# EAGLE design HPFv2 (EAGLE 6.1)
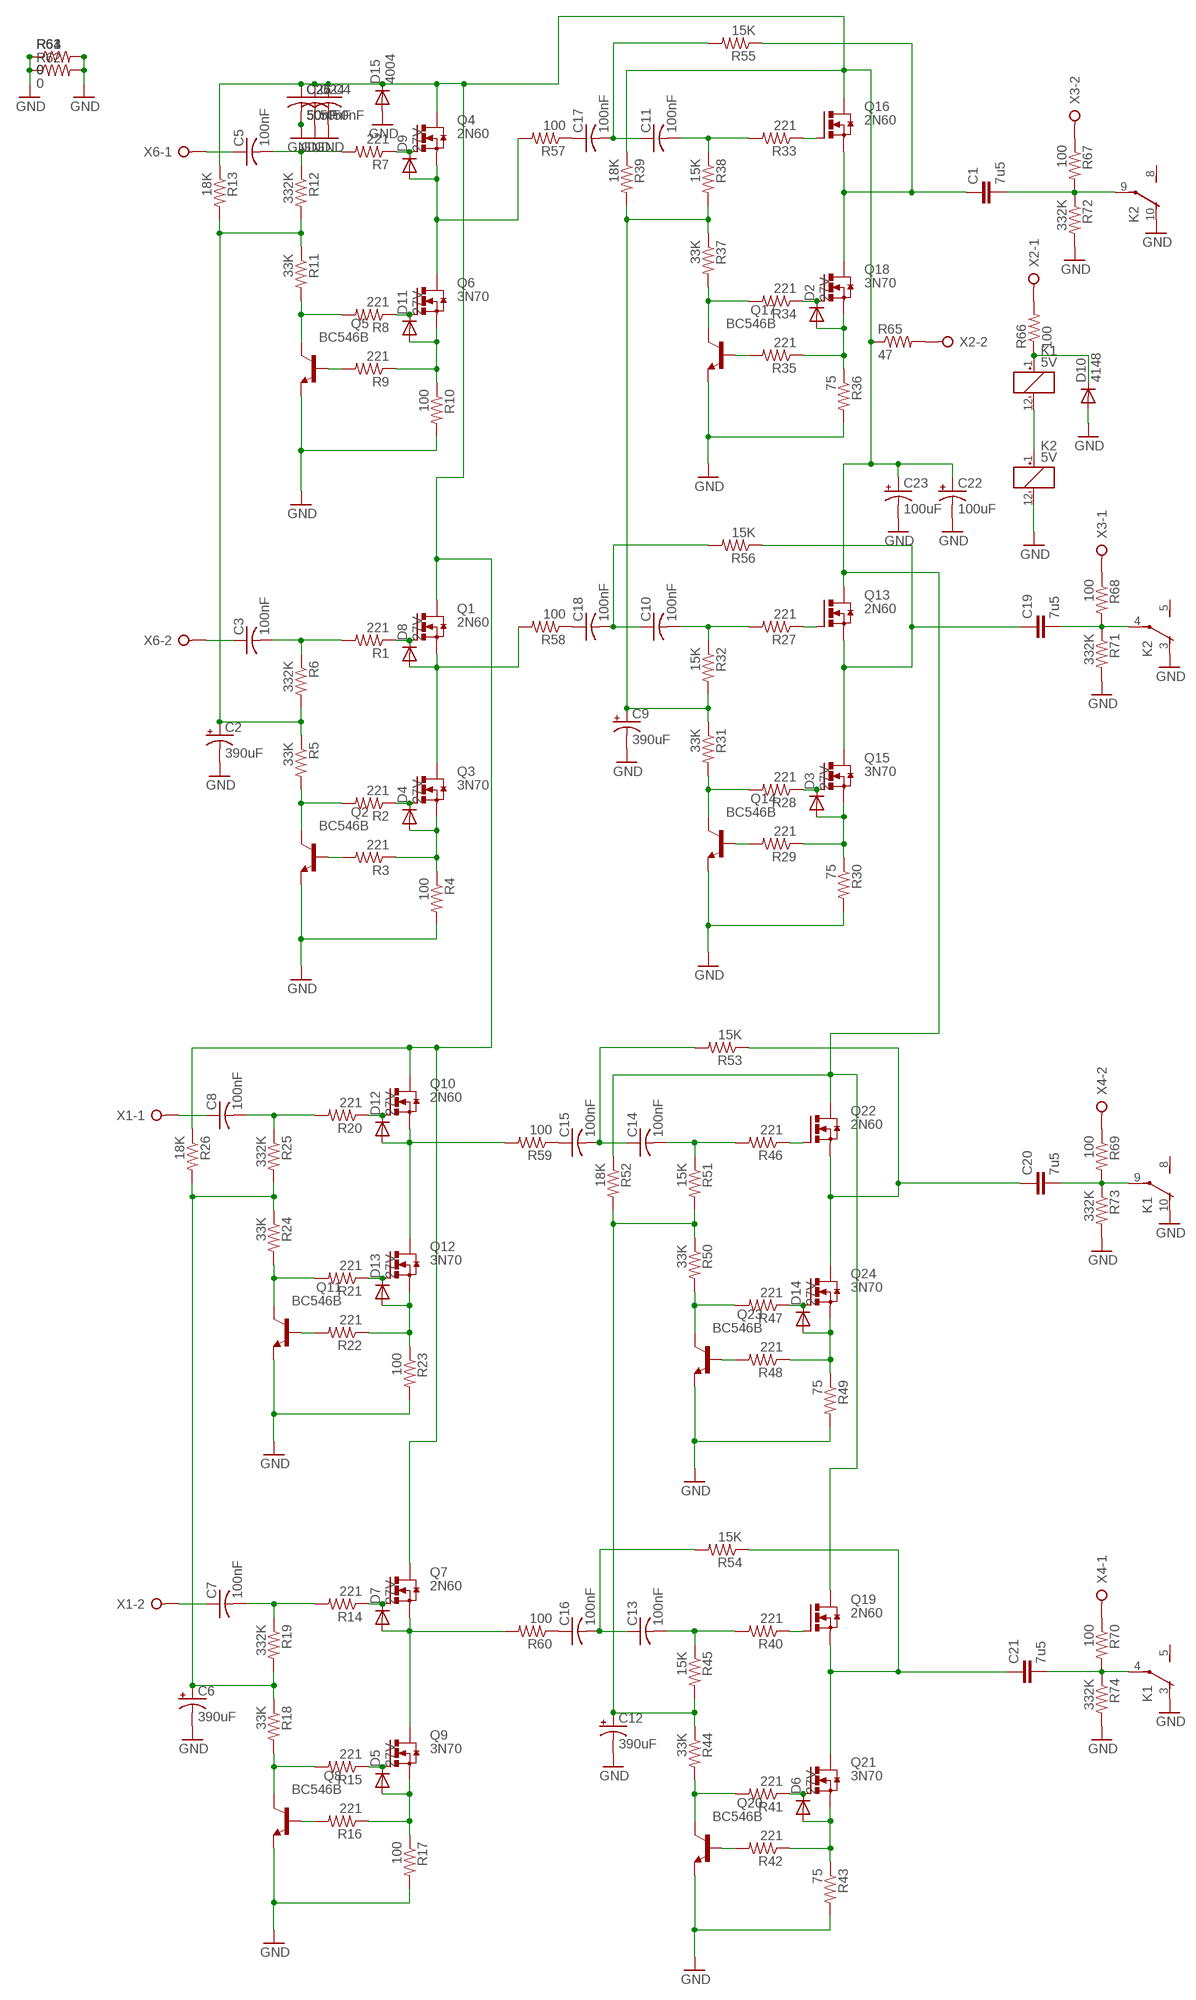
[diagram p0: schematic, sheet 1]

## Parts
C1  7u5  C37/20  [C37.5B20]
C2  390uF  CPOL-USE5-13  [E5-13]
C3  100nF  C-US050-075X075  [C050-075X075]
C4  50nF  C-US075-042X103  [C075-042X103]
C5  100nF  C-US050-075X075  [C050-075X075]
C6  390uF  CPOL-USE5-13  [E5-13]
C7  100nF  C-US050-075X075  [C050-075X075]
C8  100nF  C-US050-075X075  [C050-075X075]
C9  390uF  CPOL-USE5-13  [E5-13]
C10  100nF  C-US050-075X075  [C050-075X075]
C11  100nF  C-US050-075X075  [C050-075X075]
C12  390uF  CPOL-USE5-13  [E5-13]
C13  100nF  C-US050-075X075  [C050-075X075]
C14  100nF  C-US050-075X075  [C050-075X075]
C15  100nF  C-US050-075X075  [C050-075X075]
C16  100nF  C-US050-075X075  [C050-075X075]
C17  100nF  C-US050-075X075  [C050-075X075]
C18  100nF  C-US050-075X075  [C050-075X075]
C19  7u5  C37/20  [C37.5B20]
C20  7u5  C37/20  [C37.5B20]
C21  7u5  C37/20  [C37.5B20]
C22  100uF  CPOL-USE5-13  [E5-13]
C23  100uF  CPOL-USE5-13  [E5-13]
C24  50nF  C-US075-042X103  [C075-042X103]
C25  50nF  C-US075-042X103  [C075-042X103]
C26  50nF  C-US075-042X103  [C075-042X103]
C27  50nF  C-US075-042X103  [C075-042X103]
D2  27V  1N4148DO35-7  [DO35-7]
D3  27V  1N4148DO35-7  [DO35-7]
D4  27V  1N4148DO35-7  [DO35-7]
D5  27V  1N4148DO35-7  [DO35-7]
D6  27V  1N4148DO35-7  [DO35-7]
D7  27V  1N4148DO35-7  [DO35-7]
D8  27V  1N4148DO35-7  [DO35-7]
D9  27V  1N4148DO35-7  [DO35-7]
D10  4148  1N4148DO35-7  [DO35-7]
D11  27V  1N4148DO35-7  [DO35-7]
D12  27V  1N4148DO35-7  [DO35-7]
D13  27V  1N4148DO35-7  [DO35-7]
D14  27V  1N4148DO35-7  [DO35-7]
D15  4004  1N4148DO35-10  [DO35-10]
K1  5V  TX2-12V  [TX2]
K2  5V  TX2-12V  [TX2]
Q1  2N60  IRFI540NPBF  [TO220BH]
Q2  BC546B  BC546A  [TO92-EBC]
Q3  3N70  IRFI540NPBF  [TO220BH]
Q4  2N60  IRFI540NPBF  [TO220BH]
Q5  BC546B  BC546A  [TO92-EBC]
Q6  3N70  IRFI540NPBF  [TO220BH]
Q7  2N60  IRFI540NPBF  [TO220BH]
Q8  BC546B  BC546A  [TO92-EBC]
Q9  3N70  IRFI540NPBF  [TO220BH]
Q10  2N60  IRFI540NPBF  [TO220BH]
Q11  BC546B  BC546A  [TO92-EBC]
Q12  3N70  IRFI540NPBF  [TO220BH]
Q13  2N60  IRFI540NPBF  [TO220BH]
Q14  BC546B  BC546A  [TO92-EBC]
Q15  3N70  IRFI540NPBF  [TO220BH]
Q16  2N60  IRFI540NPBF  [TO220BH]
Q17  BC546B  BC546A  [TO92-EBC]
Q18  3N70  IRFI540NPBF  [TO220BH]
Q19  2N60  IRFI540NPBF  [TO220BH]
Q20  BC546B  BC546A  [TO92-EBC]
Q21  3N70  IRFI540NPBF  [TO220BH]
Q22  2N60  IRFI540NPBF  [TO220BH]
Q23  BC546B  BC546A  [TO92-EBC]
Q24  3N70  IRFI540NPBF  [TO220BH]
R1  221  R-US_0207/10  [0207/10]
R2  221  R-US_0207/10  [0207/10]
R3  221  R-US_0207/10  [0207/10]
R4  100  R-US_0207/10  [0207/10]
R5  33K  R-US_0207/10  [0207/10]
R6  332K  R-US_0207/10  [0207/10]
R7  221  R-US_0207/10  [0207/10]
R8  221  R-US_0207/10  [0207/10]
R9  221  R-US_0207/10  [0207/10]
R10  100  R-US_0207/10  [0207/10]
R11  33K  R-US_0207/10  [0207/10]
R12  332K  R-US_0207/10  [0207/10]
R13  18K  R-US_0207/10  [0207/10]
R14  221  R-US_0207/10  [0207/10]
R15  221  R-US_0207/10  [0207/10]
R16  221  R-US_0207/10  [0207/10]
R17  100  R-US_0207/10  [0207/10]
R18  33K  R-US_0207/10  [0207/10]
R19  332K  R-US_0207/10  [0207/10]
R20  221  R-US_0207/10  [0207/10]
R21  221  R-US_0207/10  [0207/10]
R22  221  R-US_0207/10  [0207/10]
R23  100  R-US_0207/10  [0207/10]
R24  33K  R-US_0207/10  [0207/10]
R25  332K  R-US_0207/10  [0207/10]
R26  18K  R-US_0207/10  [0207/10]
R27  221  R-US_0207/10  [0207/10]
R28  221  R-US_0207/10  [0207/10]
R29  221  R-US_0207/10  [0207/10]
R30  75  R-US_0207/10  [0207/10]
R31  33K  R-US_0207/10  [0207/10]
R32  15K  R-US_0207/10  [0207/10]
R33  221  R-US_0207/10  [0207/10]
R34  221  R-US_0207/10  [0207/10]
R35  221  R-US_0207/10  [0207/10]
R36  75  R-US_0207/10  [0207/10]
R37  33K  R-US_0207/10  [0207/10]
R38  15K  R-US_0207/10  [0207/10]
R39  18K  R-US_0207/10  [0207/10]
R40  221  R-US_0207/10  [0207/10]
R41  221  R-US_0207/10  [0207/10]
R42  221  R-US_0207/10  [0207/10]
R43  75  R-US_0207/10  [0207/10]
R44  33K  R-US_0207/10  [0207/10]
R45  15K  R-US_0207/10  [0207/10]
R46  221  R-US_0207/10  [0207/10]
R47  221  R-US_0207/10  [0207/10]
R48  221  R-US_0207/10  [0207/10]
R49  75  R-US_0207/10  [0207/10]
R50  33K  R-US_0207/10  [0207/10]
R51  15K  R-US_0207/10  [0207/10]
R52  18K  R-US_0207/10  [0207/10]
R53  15K  R-US_0207/10  [0207/10]
R54  15K  R-US_0207/10  [0207/10]
R55  15K  R-US_0207/10  [0207/10]
R56  15K  R-US_0207/10  [0207/10]
R57  100  R-US_0207/10  [0207/10]
R58  100  R-US_0207/10  [0207/10]
R59  100  R-US_0207/10  [0207/10]
R60  100  R-US_0207/10  [0207/10]
R61  0  R-US_0207/10  [0207/10]
R62  0  R-US_0204/7  [0204/7]
R63  0  R-US_0207/10  [0207/10]
R64  0  R-US_0207/10  [0207/10]
R65  47  R-US_0617/22  [0617/22]
R66  100  R-US_0309/12  [0309/12]
R67  100  R-US_0207/10  [0207/10]
R68  100  R-US_0207/10  [0207/10]
R69  100  R-US_0207/10  [0207/10]
R70  100  R-US_0207/10  [0207/10]
R71  332K  R-US_0207/10  [0207/10]
R72  332K  R-US_0207/10  [0207/10]
R73  332K  R-US_0207/10  [0207/10]
R74  332K  R-US_0207/10  [0207/10]
X1  W237-02P  [W237-132]
X2  W237-02P  [W237-132]
X3  W237-02P  [W237-132]
X4  W237-02P  [W237-132]
X6  W237-02P  [W237-132]

## Nets
GND: C2.- C4.2 C6.- C9.- C12.- C22.- C23.- C24.2 C25.2 C26.2 C27.2 D10.A D15.A K1.3(1:O) K1.10(2:O) K2.3(1:O) K2.10(2:O) K2.12(_:-) Q2.E Q5.E Q8.E Q11.E Q14.E Q17.E Q20.E Q23.E R4.2 R10.2 R17.2 R23.2 R30.2 R36.2 R43.2 R49.2 R61.1 R61.2 R62.1 R62.2 R63.1 R63.2 R64.1 R64.2 R71.2 R72.2 R73.2 R74.2
N$1: Q2.B R3.2
N$2: D4.A Q3.S R3.1 R4.1
N$3: D4.C Q3.G R2.1
N$4: Q2.C R2.2 R5.2
N$5: C3.2 R1.2 R6.1
N$6: D8.A Q1.S Q3.D R58.2
N$7: D8.C Q1.G R1.1
N$8: C5.1 X6.1
N$9: Q5.B R9.2
N$10: D11.A Q6.S R9.1 R10.1
N$11: D11.C Q6.G R8.1
N$12: Q5.C R8.2 R11.2
N$13: D9.A Q4.S Q6.D R57.2
N$14: D9.C Q4.G R7.1
N$15: C5.2 R7.2 R12.1
N$16: C2.+ R5.1 R6.2 R11.1 R12.2 R13.2
N$17: C4.1 C22.+ C23.+ C24.1 C25.1 C26.1 C27.1 D15.C Q1.D Q4.D Q7.D Q10.D Q13.D Q16.D Q19.D Q22.D R13.1 R26.1 R39.1 R52.1 R65.1
N$18: C3.1 X6.2
N$19: Q8.B R16.2
N$20: D5.A Q9.S R16.1 R17.1
N$21: D5.C Q9.G R15.1
N$22: Q8.C R15.2 R18.2
N$23: D7.A Q7.S Q9.D R60.2
N$24: D7.C Q7.G R14.1
N$25: C7.2 R14.2 R19.1
N$26: Q11.B R22.2
N$27: D13.A Q12.S R22.1 R23.1
N$28: D13.C Q12.G R21.1
N$29: Q11.C R21.2 R24.2
N$30: D12.A Q10.S Q12.D R59.2
N$31: D12.C Q10.G R20.1
N$32: C8.2 R20.2 R25.1
N$33: C6.+ R18.1 R19.2 R24.1 R25.2 R26.2
N$34: C21.2 K1.4(1:P) R70.2 R74.1
N$35: C8.1 X1.1
N$36: C7.1 X1.2
N$37: Q14.B R29.2
N$38: D3.A Q15.S R29.1 R30.1
N$39: D3.C Q15.G R28.1
N$40: Q14.C R28.2 R31.2
N$41: C19.1 Q13.S Q15.D R56.1
N$42: Q13.G R27.1
N$43: C10.2 R27.2 R32.1
N$44: Q17.B R35.2
N$45: D2.A Q18.S R35.1 R36.1
N$46: D2.C Q18.G R34.1
N$47: Q17.C R34.2 R37.2
N$48: C1.1 Q16.S Q18.D R55.1
N$49: Q16.G R33.1
N$50: C11.2 R33.2 R38.1
N$51: C9.+ R31.1 R32.2 R37.1 R38.2 R39.2
N$52: C20.2 K1.9(2:P) R69.2 R73.1
N$53: C11.1 C17.2 R55.2
N$54: C10.1 C18.2 R56.2
N$55: Q20.B R42.2
N$56: D6.A Q21.S R42.1 R43.1
N$57: D6.C Q21.G R41.1
N$58: Q20.C R41.2 R44.2
N$59: C21.1 Q19.S Q21.D R54.1
N$60: Q19.G R40.1
N$61: C13.2 R40.2 R45.1
N$62: Q23.B R48.2
N$63: D14.A Q24.S R48.1 R49.1
N$64: D14.C Q24.G R47.1
N$65: Q23.C R47.2 R50.2
N$66: C20.1 Q22.S Q24.D R53.1
N$67: Q22.G R46.1
N$68: C14.2 R46.2 R51.1
N$69: C12.+ R44.1 R45.2 R50.1 R51.2 R52.2
N$70: C19.2 K2.4(1:P) R68.2 R71.1
N$71: C14.1 C15.2 R53.2
N$72: C13.1 C16.2 R54.2
N$73: C17.1 R57.1
N$74: C18.1 R58.1
N$75: C15.1 R59.1
N$76: C16.1 R60.1
N$77: C1.2 K2.9(2:P) R67.2 R72.1
N$79: R65.2 X2.2
N$80: D10.C K1.1(_:+) R66.1
N$81: R66.2 X2.1
N$82: R68.1 X3.1
N$83: R67.1 X3.2
N$84: R69.1 X4.2
N$85: R70.1 X4.1
N$86: K1.12(_:-) K2.1(_:+)
Unconnected: K1.5(1:S) K1.8(2:S) K2.5(1:S) K2.8(2:S)

## Library data of the parts
C1 C19-C21 = capacitor-wima:C: CAPACITOR naming: grid - package width
C2 C6 C9 C12 C22 C23 = resistor:CPOL-US: POLARIZED CAPACITOR, American symbol
C3-C5 C7 C8 C10 C11 C13-C18 C24-C27 = resistor:C-US: CAPACITOR, American symbol
D2-D15 = diode:1N4148: DIODE high speed (Philips)
K1 K2 = relay:TX2?-*: 2 AMP. HIGH CAPACITY RELAY NAiS WITH HIGH SURGE VOLTAGE & HIGH BREAKDOWN VOLTAGE Source: http://www.mew-europe.com/.. en_ds_61022_0001.pdf; MF: AROMAT/ MATSUSHITA; MPN: TX2-12V; OC_FARNELL: 1200952; OC_NEWARK: 67K1295
Q1 Q3 Q4 Q6 Q7 Q9 Q10 Q12 Q13 Q15 Q16 Q18 Q19 Q21 Q22 Q24 = transistor-power:IRFI540NPBF: HEXFET Power MOISFET VDSS = 100V, RDS(on) = 0.052 Ohm, ID = 20A, VGS(th) = 2.0 -- 4.0V Source: http://www.irf.com/product-info/datasheets/data/irfi540npbf.pdf
Q2 Q5 Q8 Q11 Q14 Q17 Q20 Q23 = transistor-npn:BC546*: NPN Transistor
R1-R74 = resistor:R-US_: RESISTOR, American symbol
X1-X4 X6 = con-wago-508:W237-02P: WAGO SREW CLAMP; OC_FARNELL: unknown; OC_NEWARK: unknown

## Board
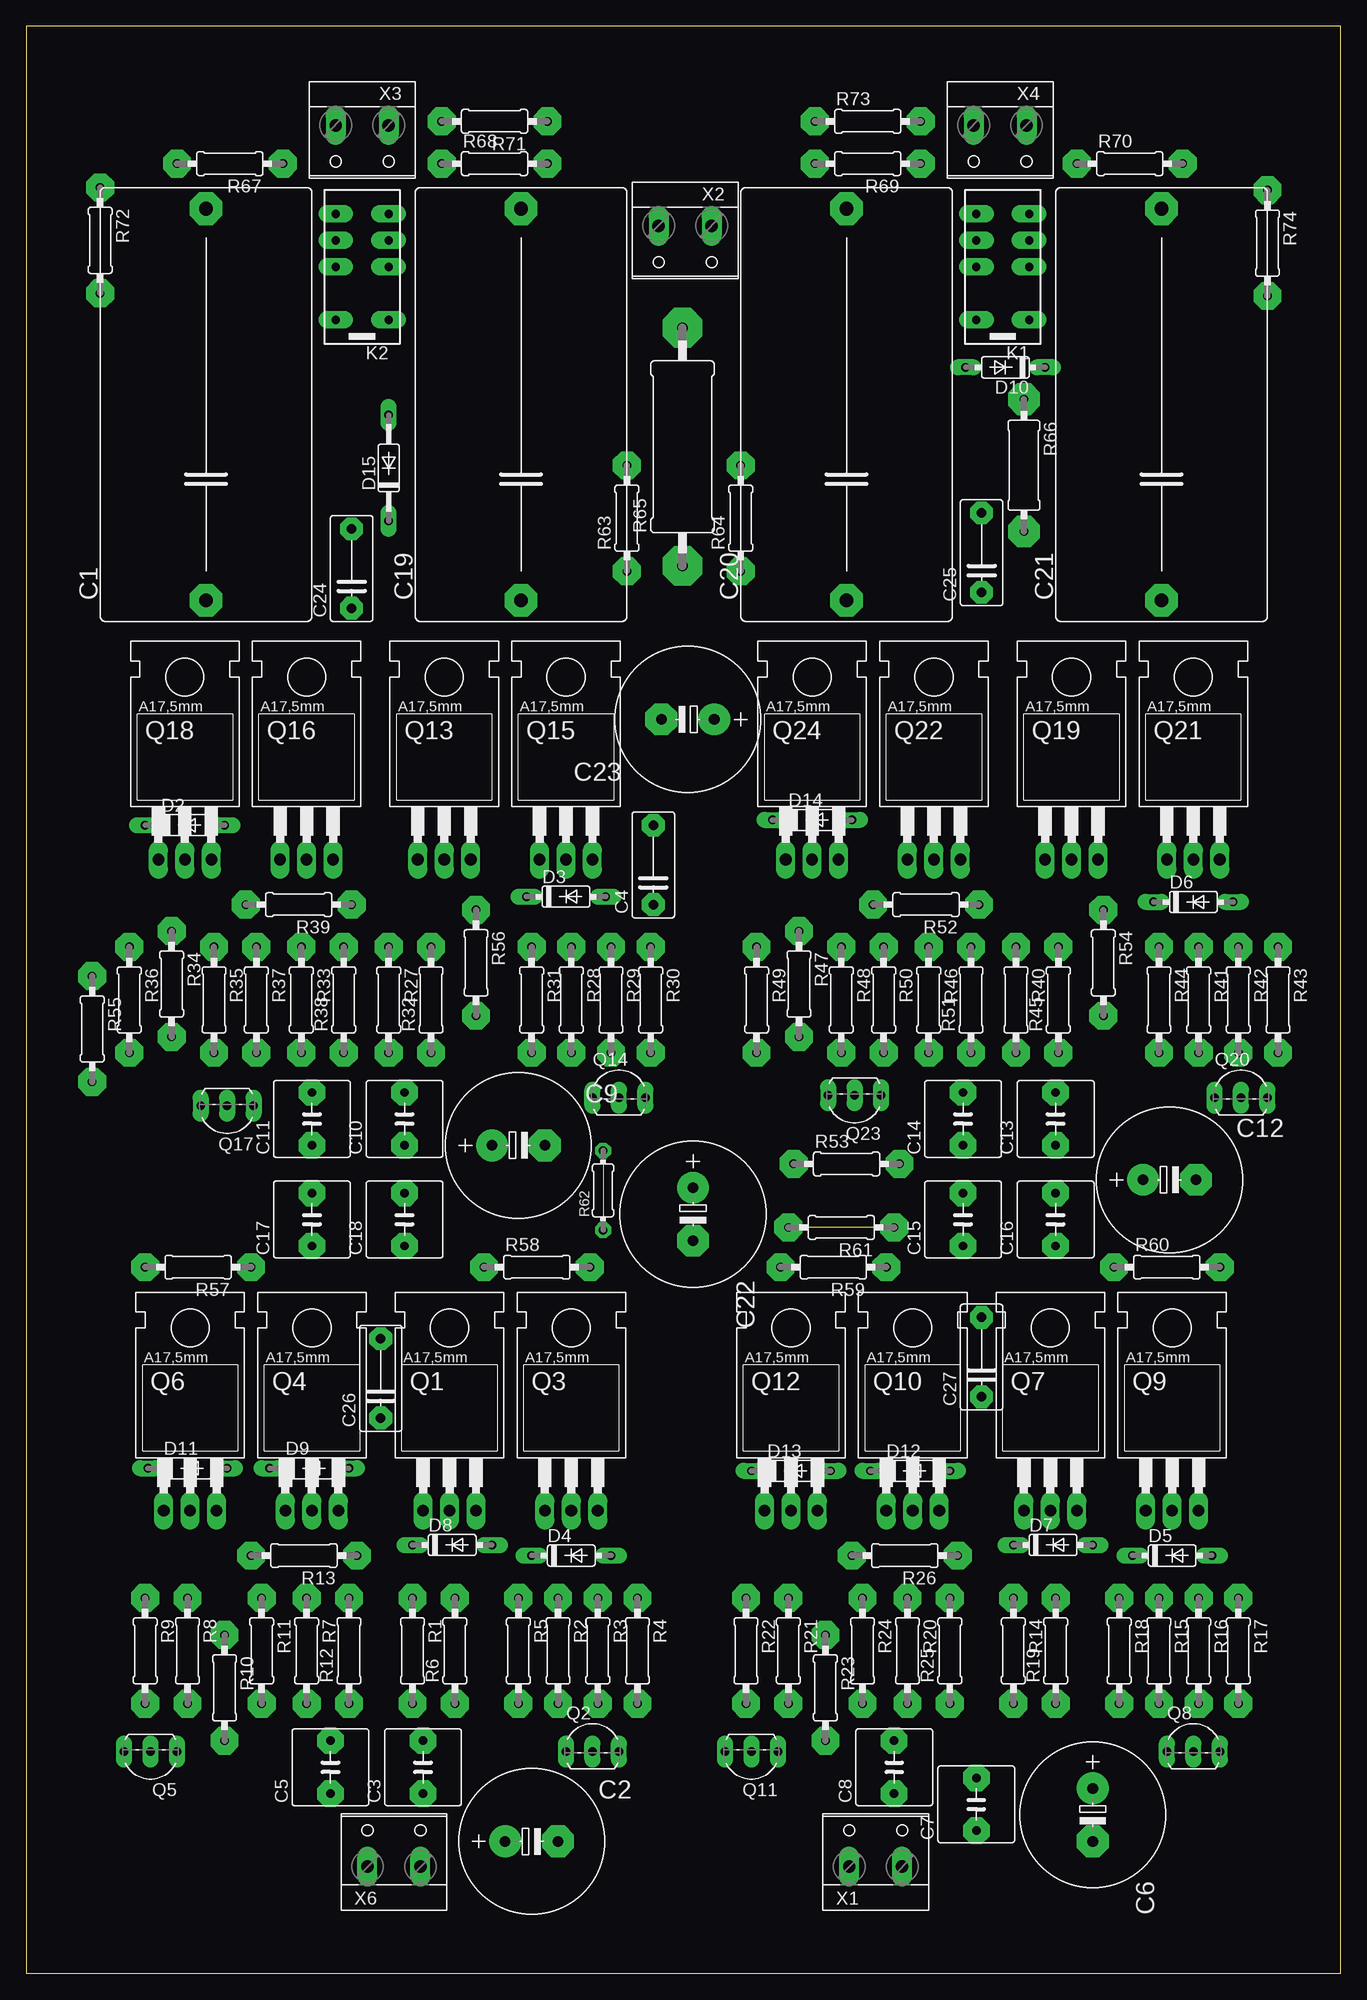
[diagram p1: board, top side]
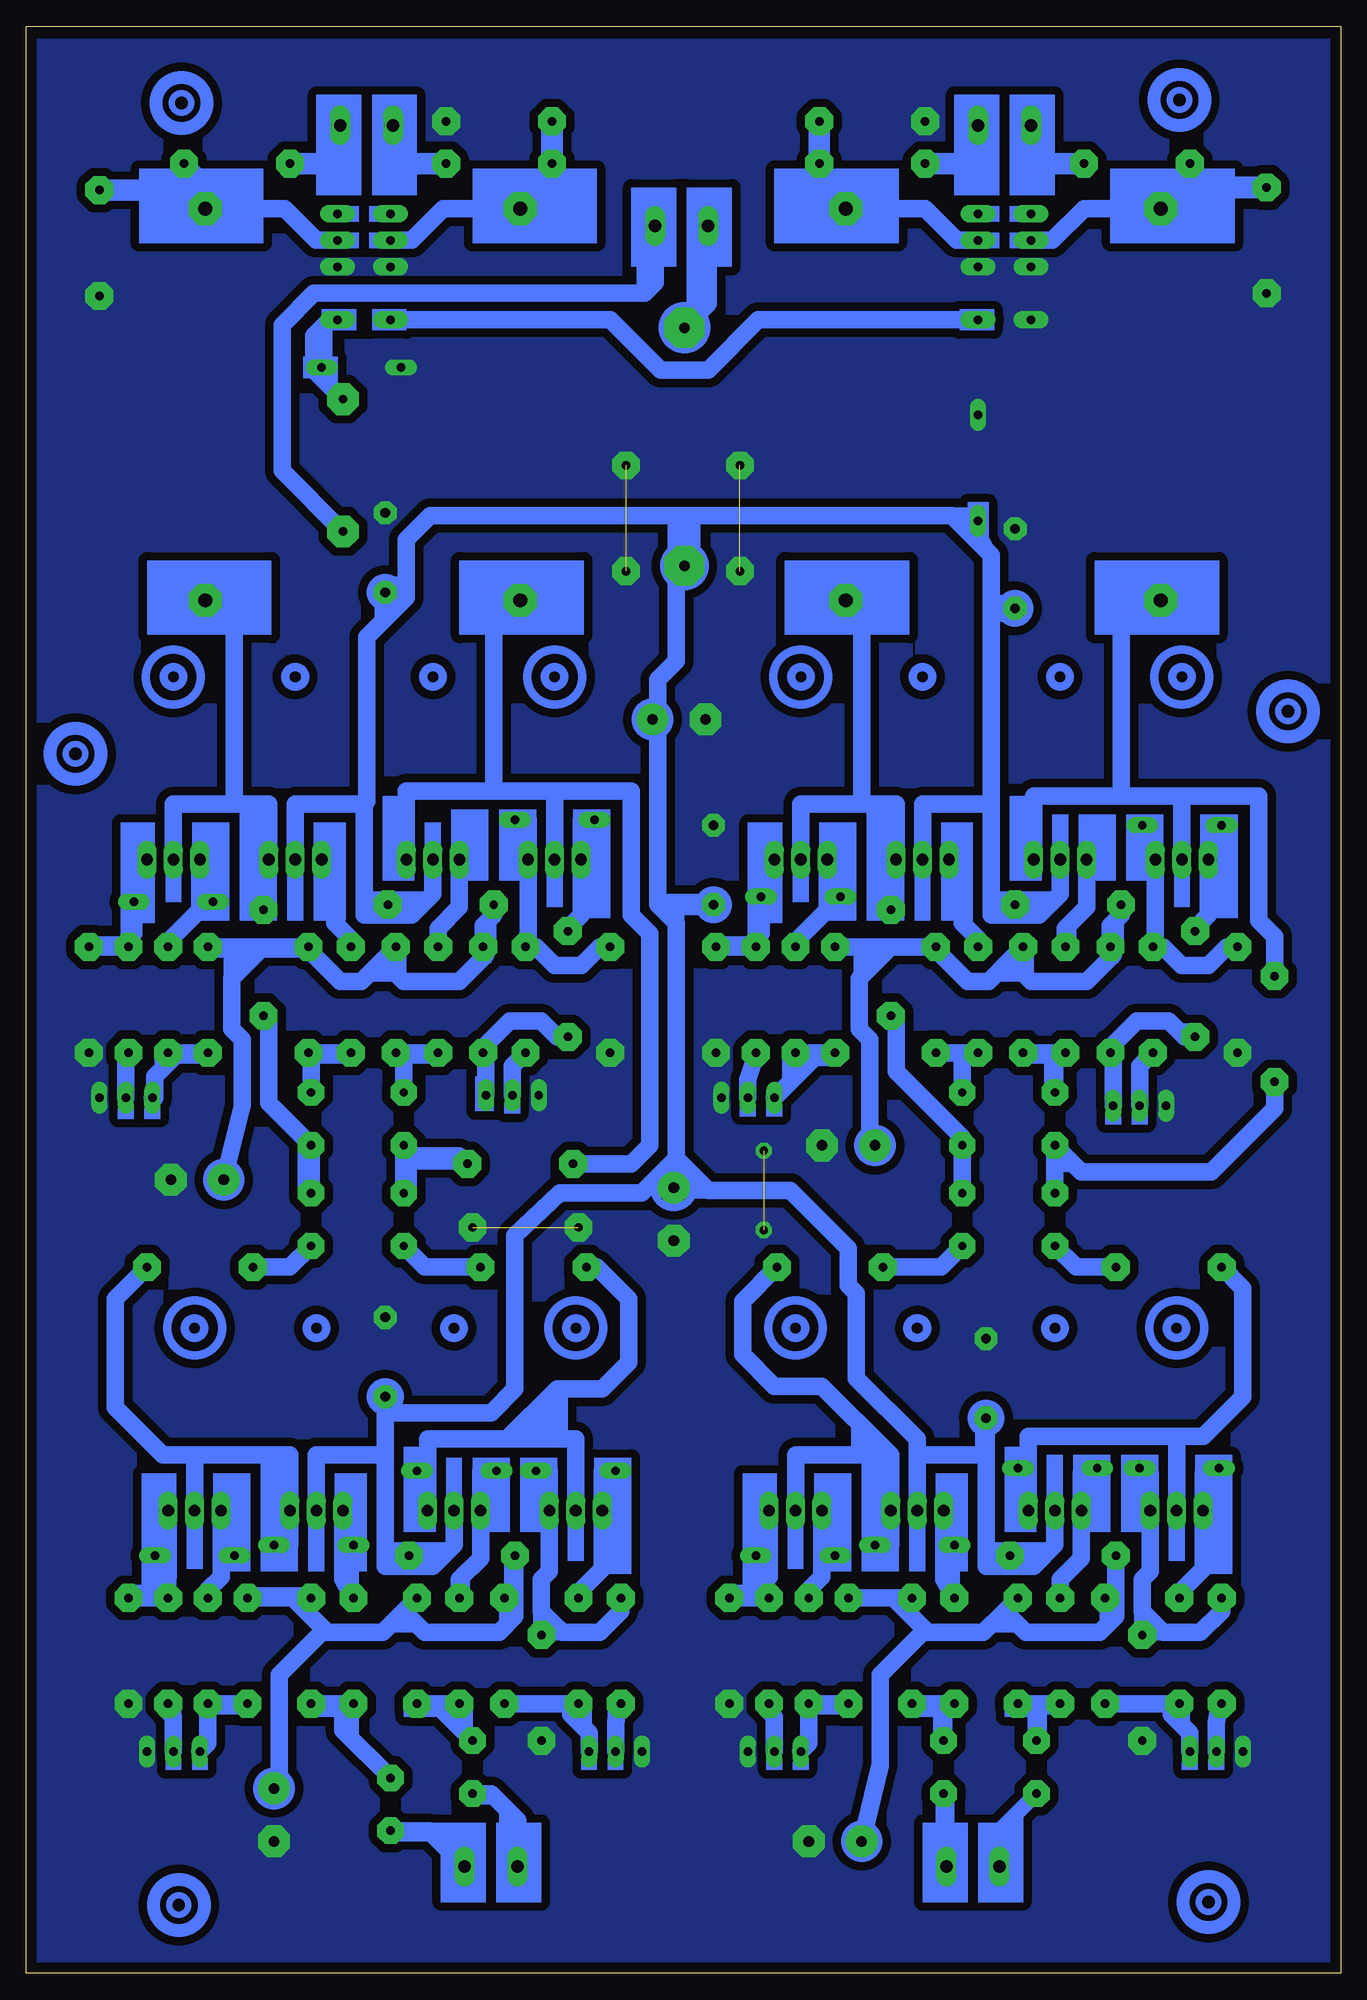
[diagram p2: board, bottom side, seen from below]

Size 126.16 x 186.92 mm. Coordinates in mm from the lower left corner, seen from the top.
Outline: 0,186.92 0,0 126.16,0 126.16,186.92 0,186.92
Copper layers (1*16): Top 0.035mm / dielectric 1.5mm / Bottom 0.035mm
Design rules: minimum track width 10mil, minimum drill 24mil, track to track 8mil, track to pad 8mil, pad to pad 8mil, via to via 8mil, smd to smd 8mil, copper to edge 40mil, drill to drill 8mil, minimum pad ring 14mil, minimum via ring 8mil, stop-mask expansion 4mil, vias tented up to drill 0mil, thermal gap 10mil

### Footprints (pad centres in the part's own frame; a part is rotated, then mirrored left to right if it is on the bottom)
C37.5B20 = drill 1.321 pad 3.15 octagon: 1 -18.796,0; 2 18.796,0
E5-13 = drill 1.016 pad 3.048: + -2.54,0 | drill 1.016 pad 3.048 octagon: - 2.54,0
C050-075X075 = drill 0.813 pad 2.54 octagon: 1 -2.54,0; 2 2.54,0
C075-042X103 = drill 0.914 pad 2.184 octagon: 1 -3.81,0; 2 3.81,0
DO35-7 = drill 0.813 long: A 3.81,0; C -3.81,0
DO35-10 = drill 0.813 long: A 5.08,0; C -5.08,0
TX2 = drill 0.8 pad 1.676 long: 1 -5.08,-2.54; 3 0,-2.54; 4 2.54,-2.54; 5 5.08,-2.54; 8 5.08,2.54; 9 2.54,2.54; 10 0,2.54; 12 -5.08,2.54
TO220BH = drill 1.118 long: D 0,-6.35; G -2.54,-6.35; S 2.54,-6.35
TO92-EBC = drill 0.813 long: B 0,-1.27; C -2.54,-1.27; E 2.54,-1.27
0207/10 = drill 0.813 pad 2.667 octagon: 1 -5.08,0; 2 5.08,0
0204/7 = drill 0.813 octagon: 1 -3.81,0; 2 3.81,0
0617/22 = drill 1.016 pad 3.81 octagon: 1 -11.43,0; 2 11.43,0
0309/12 = drill 0.813 pad 3.048 octagon: 1 -6.35,0; 2 6.35,0
W237-132 = drill 1.194 long: 1 -2.54,-0.635; 2 2.54,-0.635

### Placement (x,y rotation side)
C1  17.27,150.6 90 top
C2  48.51,12.68 0 top
C3  38.1,19.79 90 top
C4  60.2,106.41 90 top
C5  29.21,19.79 90 top
C6  102.36,15.22 270 top
C7  91.19,16.24 90 top
C8  83.31,19.79 90 top
C9  47.24,79.48 0 top
C10  36.32,82.02 90 top
C11  27.43,82.02 90 top
C12  109.73,76.18 0 top
C13  98.81,82.02 90 top
C14  89.92,82.02 90 top
C15  89.92,72.37 90 top
C16  98.81,72.37 90 top
C17  27.43,72.37 90 top
C18  36.32,72.37 90 top
C19  47.5,150.6 90 top
C20  78.74,150.6 90 top
C21  108.97,150.6 90 top
C22  64.01,72.88 270 top
C23  63.5,120.38 180 top
C24  31.24,134.85 90 top
C25  91.69,136.38 90 top
C26  34.04,57.13 90 top
C27  91.69,59.16 90 top
D2  15.24,110.22 0 top
D3  51.82,103.36 0 top
D4  52.32,40.11 0 top
D5  109.98,40.11 0 top
D6  112.01,102.85 0 top
D7  98.55,41.13 0 top
D8  40.89,41.13 0 top
D9  27.18,48.49 0 top
D10  93.98,154.16 180 top
D11  15.49,48.49 0 top
D12  84.84,48.24 0 top
D13  73.41,48.24 0 top
D14  75.44,110.72 0 top
D15  34.8,144.51 90 top
K1  93.73,163.81 90 top
K2  32.26,163.81 90 top
Q1  40.64,50.78 0 top
Q2  54.36,22.59 0 top
Q3  52.32,50.78 0 top
Q4  27.43,50.78 0 top
Q5  11.94,20.05 180 top
Q6  15.75,50.78 0 top
Q7  98.3,50.78 0 top
Q8  112.01,22.59 0 top
Q9  109.98,50.78 0 top
Q10  85.09,50.78 0 top
Q11  69.6,20.05 180 top
Q12  73.41,50.78 0 top
Q13  40.13,113.26 0 top
Q14  56.9,85.32 0 top
Q15  51.82,113.26 0 top
Q16  26.92,113.26 0 top
Q17  19.3,82.02 180 top
Q18  15.24,113.26 0 top
Q19  100.33,113.26 0 top
Q20  116.59,85.32 0 top
Q21  112.01,113.26 0 top
Q22  87.12,113.26 0 top
Q23  79.5,83.04 180 top
Q24  75.44,113.26 0 top
R1  37.08,30.97 270 top
R2  51.05,30.97 270 top
R3  54.86,30.97 270 top
R4  58.67,30.97 270 top
R5  47.24,30.97 270 top
R6  41.15,30.97 90 top
R7  26.92,30.97 270 top
R8  15.49,30.97 270 top
R9  11.43,30.97 270 top
R10  19.05,27.41 270 top
R11  22.61,30.97 270 top
R12  30.99,30.97 90 top
R13  26.67,40.11 180 top
R14  94.74,30.97 270 top
R15  108.71,30.97 270 top
R16  112.52,30.97 270 top
R17  116.33,30.97 270 top
R18  104.9,30.97 270 top
R19  98.81,30.97 90 top
R20  84.58,30.97 270 top
R21  73.15,30.97 270 top
R22  69.09,30.97 270 top
R23  76.71,27.41 270 top
R24  80.26,30.97 270 top
R25  88.65,30.97 90 top
R26  84.33,40.11 180 top
R27  34.8,93.45 270 top
R28  52.32,93.45 270 top
R29  56.13,93.45 270 top
R30  59.94,93.45 270 top
R31  48.51,93.45 270 top
R32  38.86,93.45 90 top
R33  26.42,93.45 270 top
R34  13.97,94.98 270 top
R35  18.03,93.45 270 top
R36  9.91,93.45 270 top
R37  22.1,93.45 270 top
R38  30.48,93.45 90 top
R39  26.16,102.6 180 top
R40  95,93.45 270 top
R41  112.52,93.45 270 top
R42  116.33,93.45 270 top
R43  120.14,93.45 270 top
R44  108.71,93.45 270 top
R45  99.06,93.45 90 top
R46  86.61,93.45 270 top
R47  74.17,94.98 270 top
R48  78.23,93.45 270 top
R49  70.1,93.45 270 top
R50  82.3,93.45 270 top
R51  90.68,93.45 90 top
R52  86.36,102.6 180 top
R53  78.74,77.7 0 top
R54  103.38,97.01 270 top
R55  6.35,90.66 270 top
R56  43.18,97.01 270 top
R57  16.51,67.8 180 top
R58  49.02,67.8 0 top
R59  77.47,67.8 180 top
R60  109.47,67.8 0 top
R61  78.23,71.61 180 top
R62  55.37,75.16 90 top
R63  57.66,139.68 90 top
R64  68.58,139.68 90 top
R65  62.99,146.54 90 top
R66  95.76,144.76 270 top
R67  19.56,173.72 180 top
R68  44.96,173.72 0 top
R69  80.77,173.72 180 top
R70  105.92,173.72 0 top
R71  44.96,177.78 180 top
R72  7.11,166.35 270 top
R73  80.77,177.78 0 top
R74  119.13,166.1 270 top
X1  81.53,10.9 0 top
X2  63.25,167.11 180 top
X3  32.26,176.76 180 top
X4  93.47,176.76 180 top
X6  35.31,10.9 0 top

### Tracks (layer width: path | path; a pad name or v marks a point on that pad's centre or on a via)
GND  (4 unrouted)
  pour Bottom (isolate 0.813, no thermals): 125.22,184.89 0.25,184.89 0.25,1.76 125.22,1.76
N$1
  Bottom 1.676: Q2.B 54.36,24.62 54.86,25.13 R3.2
N$2
  Bottom 1.676: 56.9,36.05 R3.1 | 56.9,36.05 54.86,38.08 54.86,40.11 | 54.86,40.11 Q3.S | R4.1 56.9,36.05 | D4.A 54.86,40.11
N$3
  Bottom 1.676: R2.1 51.05,36.81 49.78,38.08 49.78,40.11 | 49.78,40.11 Q3.G | D4.C 49.78,40.11
N$4
  Bottom 1.676: Q2.C 51.05,22.08 R2.2 R5.2
N$5
  Bottom 1.676: R1.2 38.1,25.89 | 38.1,25.89 R6.1 | C3.2 38.1,25.89
N$6
  Bottom 1.676: 43.43,49.76 43.18,49.76 Q1.S 43.18,41.13 D8.A | 43.43,49.76 52.32,49.76 Q3.D | R58.2 57.4,64.5 57.4,59.42 54.36,56.37 49.78,56.37 43.43,50.02 43.43,49.76
N$7
  Bottom 1.676: R1.1 38.1,37.83 38.1,40.87 38.1,41.13 | 38.1,41.13 Q1.G | D8.C 38.1,41.13
N$8
  Bottom 1.422: C5.1 32.77,13.7 X6.1
N$9
  Bottom 1.676: Q5.B 11.94,24.11 11.68,25.63 R9.2
N$10
  Bottom 1.676: R9.1 11.43,34.78 13.46,32.75 17.02,32.75 18.03,33.76 | 18.03,33.76 19.05,34.78 19.05,37.83 18.29,38.59 Q6.S 18.29,47.99 D11.A | R10.1 18.03,33.51 18.03,33.76
N$11
  Bottom 1.676: R8.1 15.49,36.56 13.21,38.84 Q6.G 13.21,47.99 D11.C
N$12
  Bottom 1.676: R8.2 16.26,25.89 | 16.26,25.89 R11.2 | Q5.C 14.48,23.09 16.26,24.87 16.26,25.89
N$13
  Bottom 1.676: Q6.D 15.75,51.54 | 15.75,51.54 29.97,51.54 29.97,47.99 | R57.2 9.4,65.77 9.4,55.35 13.21,51.54 15.75,51.54 | D9.A 29.97,47.99 | 29.97,47.99 Q4.S
N$14
  Bottom 1.676: R7.1 26.92,37.83 24.89,39.86 Q4.G 24.89,47.99 D9.C
N$15
  Bottom 1.676: R7.2 29.21,25.89 | 29.21,25.89 R12.1 | C5.2 29.21,25.89
N$16
  Bottom 1.676: 32.26,34.78 30.23,32.75 23.11,32.75 21.59,34.27 21.59,35.79 | R12.2 32.26,34.78 | 32.26,34.78 34.29,32.75 39.62,32.75 | 39.62,32.75 42.93,36.05 | 42.93,36.05 R6.2 | R5.1 42.93,36.05 | 21.59,35.79 R13.2 | R11.1 22.35,35.79 21.59,35.79 | C2.+ 44.2,20.05 44.2,28.68 40.13,32.75 39.62,32.75
N$17
  Bottom 1.676: Q4.D 27.43,41.13 29.46,39.1 31.24,39.1 | 31.24,39.1 34.04,39.1 34.04,49.76 | 34.04,49.76 40.64,49.76 Q1.D 40.64,51.29 46.48,57.13 46.48,65.26 47.24,66.02 47.24,69.58 52.83,75.16 60.71,75.16 63.37,77.83 | R13.1 31.24,39.86 31.24,39.1 | Q10.D 85.09,41.13 87.12,39.1 88.9,39.1 | 88.9,39.1 91.69,39.1 91.69,49.76 | 91.69,49.76 98.3,49.76 Q7.D | R26.1 88.9,39.86 88.9,39.1 | 91.69,53.83 81.53,53.83 79.25,56.11 79.25,70.85 74.93,74.91 67.06,74.91 63.75,78.21 | 91.69,53.83 91.69,49.76 | Q16.D 26.92,103.61 28.96,101.58 30.73,101.58 | 30.73,101.58 33.53,101.58 33.53,112.25 33.78,112.25 | R39.1 30.73,102.34 30.73,101.58 | Q22.D 87.12,103.61 89.15,101.58 90.93,101.58 | 90.93,101.58 93.73,101.58 93.73,112.25 | 93.73,112.25 100.33,112.25 Q19.D | R52.1 90.93,102.34 90.93,101.58 | 63.37,77.83 63.75,78.21 | Q13.D 40.13,112.25 33.78,112.25 | 33.78,112.25 33.53,112.5 33.53,131.04 | 33.53,131.04 33.53,136.12 34.29,136.89 | 34.29,136.89 35.18,137.78 | 35.18,137.78 37.34,139.93 63.75,139.93 | C22.+ 63.37,75.42 63.37,77.83 | 63.75,78.21 63.75,100.82 65.15,102.22 | 65.15,102.22 65.53,102.6 65.53,120.38 | C4.1 64.52,102.6 64.9,102.22 65.15,102.22 | C23.+ 65.53,120.38 | 65.53,120.38 65.53,124.19 63.75,125.96 63.75,135.11 | 63.75,135.11 63.75,139.93 | R65.1 63.75,135.11 | 34.29,137.14 34.29,136.89 | C24.1 33.53,131.04 | C26.1 34.04,49.76 | C27.1 91.69,53.83 | D15.C 35.18,139.04 35.18,137.78 | 93.73,112.25 93.47,112.5 93.47,128.25 89.66,132.06 | 89.66,132.06 89.66,137.65 87.38,139.93 63.75,139.93 | C25.1 91.19,132.06 89.66,132.06
N$18
  Bottom 1.422: C3.1 37.85,17 X6.2
N$19
  Bottom 1.676: Q8.B 112.01,24.62 112.52,25.13 R16.2
N$20
  Bottom 1.676: 114.55,36.05 R16.1 | 114.55,36.05 112.52,38.08 112.52,40.11 | 112.52,40.11 Q9.S | R17.1 114.55,36.05 | D5.A 112.52,40.11
N$21
  Bottom 1.676: R15.1 108.71,36.81 107.44,38.08 107.44,39.86 107.44,40.11 | 107.44,40.11 Q9.G | D5.C 107.44,40.11
N$22
  Bottom 1.676: Q8.C 108.71,22.08 R15.2 R18.2
N$23
  Bottom 1.676: 109.98,49.76 100.84,49.76 Q7.S 100.84,41.13 D7.A | 109.98,49.76 Q9.D | R60.2 117.6,64.75 117.6,54.34 113.03,49.76 109.98,49.76
N$24
  Bottom 1.676: R14.1 95.76,37.83 95.76,41.13 | 95.76,41.13 Q7.G | D7.C 95.76,41.13
N$25
  Bottom 1.676: R14.2 95.76,25.89 | 95.76,25.89 R19.1 | C7.2 95.76,23.35 95.76,25.89
N$26
  Bottom 1.676: Q11.B 69.6,24.11 69.34,25.63 R22.2
N$27
  Bottom 1.676: R22.1 69.09,34.78 71.12,32.75 74.68,32.75 75.69,33.76 | 75.69,33.76 76.71,34.78 76.71,37.83 75.95,38.59 Q12.S 75.95,48.24 D13.A | R23.1 75.69,33.51 75.69,33.76
N$28
  Bottom 1.676: R21.1 73.15,36.56 70.87,38.84 Q12.G 70.87,48.24 D13.C
N$29
  Bottom 1.676: R21.2 73.91,25.89 | 73.91,25.89 R24.2 | Q11.C 72.14,23.09 73.91,24.87 73.91,25.89
N$30
  Bottom 1.676: Q12.D 73.41,51.29 80.01,51.29 | 80.01,51.29 87.63,51.29 87.63,48.24 | Q10.S 87.63,45.19 87.63,48.24 | R59.2 71.37,67.8 68.33,64.75 68.33,58.65 70.87,56.11 75.18,56.11 80.01,51.29 | D12.A 87.63,48.24
N$31
  Bottom 1.676: R20.1 84.58,37.83 82.55,39.86 Q10.G 82.55,48.24 D12.C
N$32
  Bottom 1.676: R20.2 86.87,25.89 | R25.1 87.38,25.89 86.87,25.89 | C8.2 86.87,25.89
N$33
  Bottom 1.676: 89.92,34.78 87.88,32.75 80.77,32.75 79.25,34.27 79.25,35.79 | R25.2 89.92,34.78 | 89.92,34.78 91.95,32.75 97.28,32.75 | 97.28,32.75 100.58,36.05 | 100.58,36.05 R19.2 | R18.1 100.58,36.05 | 79.25,35.79 R26.2 | R24.1 80.01,35.79 79.25,35.79 | C6.+ 101.85,18.27 101.85,28.68 97.79,32.75 97.28,32.75
N$34
  Bottom 1.676: K1.4 98.3,166.35 101.35,169.4 C21.2 108.97,171.18 | R70.2 108.97,171.68 108.97,171.18 | R74.1 108.97,171.18
N$35
  Bottom 1.676: C8.1 81.53,17.25 78.99,14.71 X1.1
N$36
  Bottom 1.676: X1.2 87.5,13.7 C7.1
N$37
  Bottom 1.676: 56.39,88.12 R29.2 56.13,88.12 56.9,85.83 Q14.B
N$38
  Bottom 1.676: R30.1 56.9,98.53 | R29.1 56.9,98.53 | 56.9,98.53 55.63,99.8 D3.A 55.63,104.63 54.36,105.9 Q15.S
N$39
  Bottom 1.676: R28.1 52.07,98.79 52.07,99.29 49.28,102.09 49.28,103.61 | 49.28,103.61 Q15.G | D3.C 49.28,103.61
N$40
  Bottom 1.676: Q14.C 50.04,88.37 | 50.04,88.37 R31.2 | R28.2 50.04,88.37
N$41
  Bottom 1.676: 45.97,112.25 42.67,112.25 Q13.S 43.18,106.41 R56.1 | 45.97,112.25 51.82,112.25 Q15.D | C19.1 45.97,130.28 45.97,112.25
N$42
  Bottom 1.676: R27.1 34.8,99.29 36.32,100.82 36.32,106.41 36.83,106.91 Q13.G
N$43
  Bottom 1.676: R27.2 36.32,88.37 | 36.32,88.37 R32.1 | C10.2 36.32,88.37
N$44
  Bottom 1.676: R35.2 19.3,87.1 Q17.B
N$45
  Bottom 1.676: R36.1 10.92,98.53 12.7,96.75 15.24,96.75 17.02,98.53 R35.1 18.03,98.79 17.78,99.04 Q18.S 19.05,106.91 D2.A
N$46
  Bottom 1.676: R34.1 13.97,100.31 12.7,101.58 Q18.G 11.43,106.91 D2.C
N$47
  Bottom 1.676: Q17.C 21.84,88.12 R37.2 22.1,88.88 19.56,91.42 16.51,91.42 14.99,89.9 R34.2
N$48
  Bottom 1.676: Q18.D 15.24,113.01 | 15.24,113.01 21.08,113.01 | 21.08,113.01 29.46,113.01 Q16.S | 15.24,113.01 7.87,113.01 7.87,101.07 6.35,99.55 R55.1 | C1.1 21.08,130.79 21.08,113.01
N$49
  Bottom 1.676: R33.1 26.42,100.31 24.38,102.34 Q16.G
N$50
  Bottom 1.676: R33.2 27.43,88.37 | 27.43,88.37 R38.1 | C11.2 27.43,88.37
N$51
  Bottom 1.676: 31.75,97.26 29.72,95.23 24.38,95.23 21.84,97.77 21.84,98.53 R37.1 22.1,100.56 21.08,101.58 R39.2 | R38.2 31.75,97.26 | 31.75,97.26 33.78,95.23 35.81,95.23 39.12,98.53 | 39.12,98.53 R32.2 | R31.1 43.18,98.53 | 43.18,98.53 39.12,98.53 | C9.+ 45.21,79.99 45.21,89.64 46.23,90.66 46.23,95.48 43.18,98.53
N$52
  Bottom 1.676: K1.9 89.15,166.35 86.11,169.4 C20.2 75.69,172.45 R69.2 R73.1
N$53
  Bottom 1.676: C17.2 C11.1 24.89,76.94 12.45,76.94 6.35,83.04 R55.2
N$54
  Bottom 1.676: R56.2 42.67,91.42 42.67,86.85 42.67,86.59 36.32,80.24 C10.1 C18.2
N$55
  Bottom 1.676: R42.2 116.59,88.12 Q20.B
N$56
  Bottom 1.676: R43.1 117.09,98.53 | R42.1 117.09,98.53 | 117.09,98.53 115.82,99.8 115.82,102.6 D6.A 115.82,104.63 114.55,105.9 Q21.S
N$57
  Bottom 1.676: R41.1 112.27,98.79 112.27,99.29 109.47,102.09 109.47,102.85 | 109.47,102.85 Q21.G | D6.C 109.47,102.85
N$58
  Bottom 1.676: R44.2 112.01,88.37 | 112.01,88.37 R41.2 | Q20.C 113.79,84.05 113.79,86.09 112.01,87.86 112.01,88.37
N$59
  Bottom 1.676: 106.17,112.25 102.87,112.25 Q19.S 103.38,106.41 R54.1 | 106.17,112.25 112.01,112.25 Q21.D | C21.1 106.17,131.3 106.17,112.25
N$60
  Bottom 1.676: R40.1 95,99.29 96.52,100.82 96.52,106.41 97.03,106.91 Q19.G
N$61
  Bottom 1.676: 98.81,88.37 R45.1 | C13.2 98.81,88.37 | R40.2 98.81,88.37
N$62
  Bottom 1.676: R48.2 79.5,87.1 Q23.B
N$63
  Bottom 1.676: R49.1 71.12,98.53 72.9,96.75 75.44,96.75 77.22,98.53 R48.1 78.23,98.79 77.98,99.04 Q24.S 77.98,110.72 D14.A
N$64
  Bottom 1.676: R47.1 74.17,100.31 72.9,101.58 Q24.G 72.9,110.72 D14.C
N$65
  Bottom 1.676: Q23.C 82.04,88.12 R50.2 82.3,88.88 79.76,91.42 76.71,91.42 75.18,89.9 R47.2
N$66
  Bottom 1.676: Q24.D 75.44,113.52 | 75.44,113.52 81.28,113.52 | 81.28,113.52 89.66,113.52 Q22.S | 75.44,113.52 68.07,113.52 68.07,101.58 66.29,99.8 66.29,79.48 68.07,77.7 R53.1 | C20.1 81.28,131.81 81.28,113.52
N$67
  Bottom 1.676: R46.1 86.61,100.31 84.58,102.34 Q22.G
N$68
  Bottom 1.676: R46.2 89.92,88.37 | C14.2 89.92,88.37 | R51.1 89.92,88.37
N$69
  Bottom 1.676: 91.95,97.26 89.92,95.23 84.58,95.23 82.04,97.77 82.04,98.53 R50.1 82.3,100.56 81.28,101.58 R52.2 | R51.2 91.95,97.26 | 91.95,97.26 93.98,95.23 96.01,95.23 99.31,98.53 | 99.31,98.53 R45.2 | R44.1 103.38,98.53 | 103.38,98.53 99.31,98.53 | C12.+ 105.41,83.29 105.41,89.64 106.43,90.66 106.43,95.48 103.38,98.53
N$70
  Bottom 1.676: K2.4 36.83,166.35 39.88,169.4 C19.2 50.04,171.94 R68.2 R71.1
N$71
  Bottom 1.676: C15.2 C14.1 88.9,78.47 84.58,78.47 R53.2
N$72
  Bottom 1.676: R54.2 102.87,91.42 102.87,83.55 C13.1 C16.2
N$73
  Bottom 1.676: C17.1 25.4,67.8 R57.1
N$74
  Bottom 1.676: C18.1 38.35,67.8 R58.1
N$75
  Bottom 1.676: C15.1 87.88,67.8 R59.1
N$76
  Bottom 1.676: C16.1 100.84,67.8 R60.1
N$77
  Bottom 1.676: K2.9 27.69,166.35 24.64,169.4 C1.2 16.89,169.78 | 16.89,169.78 14.48,172.19 R67.2 | R72.1 16.89,171.43 16.89,169.78
N$79
  Bottom 1.676: R65.2 60.71,160.25 X2.2
N$80
  Bottom 1.676: R66.1 98.55,153.9 98.55,154.16 | 98.55,154.16 98.55,157.21 97.03,158.73 K1.1 | D10.C 98.55,154.16
N$81
  Bottom 1.676: R66.2 101.6,144.25 101.6,158.22 98.55,161.27 66.8,161.27 65.79,162.29 X2.1
N$82
  Bottom 1.676: X3.1 34.8,173.72 R68.1
N$83
  Bottom 1.676: X3.2 29.72,173.72 R67.1
N$84
  Bottom 1.676: X4.2 90.93,173.72 R69.1
N$85
  Bottom 1.676: X4.1 96.01,173.72 R70.1
N$86
  Bottom 1.676: K2.1 55.88,158.73 60.71,153.9 65.28,153.9 70.1,158.73 K1.12
(copper drawn outside any net)
  shapes: Bottom area x292, Bottom circle x53